# EAGLE design Small 2 (EAGLE 9.5.2)
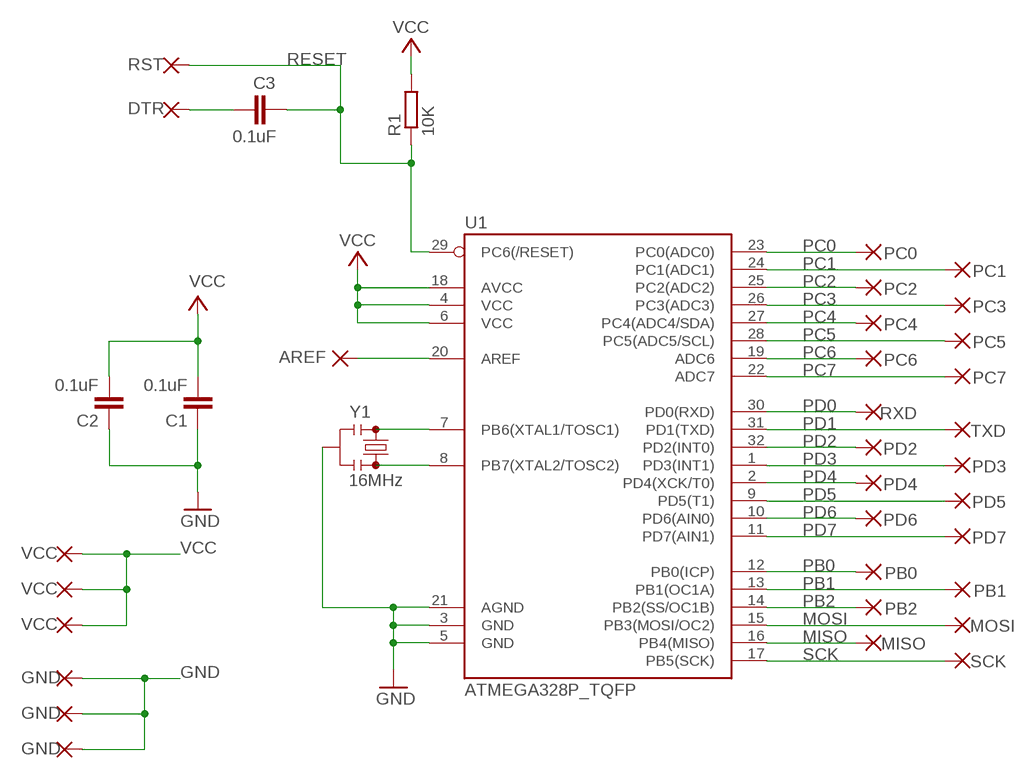
[diagram p0: schematic, sheet 1]

## Parts
AREF  1,6/0,8  [1,6/0,8]
C1  0.1uF  C-EUC0603  [C0603]
C2  0.1uF  C-EUC0603  [C0603]
C3  0.1uF  C-EUC0603  [C0603]
DTR  1,6/0,8  [1,6/0,8]
DTR1  RST  1,6/0,8  [1,6/0,8]
GND  GND  1,6/0,8  [1,6/0,8]
GND3  GND  1,6/0,8  [1,6/0,8]
GND4  GND  1,6/0,8  [1,6/0,8]
MISO  MISO  1,6/0,8  [1,6/0,8]
MOSI  MOSI  1,6/0,8  [1,6/0,8]
PB0  1,6/0,8  [1,6/0,8]
PB1  1,6/0,8  [1,6/0,8]
PB2  1,6/0,8  [1,6/0,8]
PC0  1,6/0,8  [1,6/0,8]
PC1  1,6/0,8  [1,6/0,8]
PC2  1,6/0,8  [1,6/0,8]
PC3  1,6/0,8  [1,6/0,8]
PC4  1,6/0,8  [1,6/0,8]
PC5  1,6/0,8  [1,6/0,8]
PC6  1,6/0,8  [1,6/0,8]
PC7  1,6/0,8  [1,6/0,8]
PD2  1,6/0,8  [1,6/0,8]
PD3  1,6/0,8  [1,6/0,8]
PD4  1,6/0,8  [1,6/0,8]
PD5  1,6/0,8  [1,6/0,8]
PD6  1,6/0,8  [1,6/0,8]
PD7  1,6/0,8  [1,6/0,8]
R1  10K  R-EU_R0603  [R0603]
RXD  1,6/0,8  [1,6/0,8]
SCK  SCK  1,6/0,8  [1,6/0,8]
TXD  1,6/0,8  [1,6/0,8]
U1  ATMEGA328P_TQFP  [TQFP32-08]
VCC  VCC  1,6/0,8  [1,6/0,8]
VCC1  VCC  1,6/0,8  [1,6/0,8]
VCC2  VCC  1,6/0,8  [1,6/0,8]
Y1  16MHz  RESONATOR-16MHZSMD_3.2X1.3  [RESONATOR-SMD-3.2X1.3]

## Nets
GND: C1.1 C2.1 GND3.1(P) GND4.1(P) GND.1(P) U1.3(GND) U1.5(GND) U1.21(AGND) Y1.2
MISO: MISO.1(P) U1.16(PB4(MISO))
MOSI: MOSI.1(P) U1.15(PB3(MOSI/OC2))
N$1: C3.1 DTR.1(P)
N$2: U1.7(PB6(XTAL1/TOSC1)) Y1.1
N$3: U1.8(PB7(XTAL2/TOSC2)) Y1.3
N$5: AREF.1(P) U1.20(AREF)
PB0: PB0.1(P) U1.12(PB0(ICP))
PB1: PB1.1(P) U1.13(PB1(OC1A))
PB2: PB2.1(P) U1.14(PB2(SS/OC1B))
PC0: PC0.1(P) U1.23(PC0(ADC0))
PC1: PC1.1(P) U1.24(PC1(ADC1))
PC2: PC2.1(P) U1.25(PC2(ADC2))
PC3: PC3.1(P) U1.26(PC3(ADC3))
PC4: PC4.1(P) U1.27(PC4(ADC4/SDA))
PC5: PC5.1(P) U1.28(PC5(ADC5/SCL))
PC6: PC6.1(P) U1.19(ADC6)
PC7: PC7.1(P) U1.22(ADC7)
PD0: RXD.1(P) U1.30(PD0(RXD))
PD1: TXD.1(P) U1.31(PD1(TXD))
PD2: PD2.1(P) U1.32(PD2(INT0))
PD3: PD3.1(P) U1.1(PD3(INT1))
PD4: PD4.1(P) U1.2(PD4(XCK/T0))
PD5: PD5.1(P) U1.9(PD5(T1))
PD6: PD6.1(P) U1.10(PD6(AIN0))
PD7: PD7.1(P) U1.11(PD7(AIN1))
RESET: C3.2 DTR1.1(P) R1.1 U1.29(PC6(/RESET))
SCK: SCK.1(P) U1.17(PB5(SCK))
VCC: C1.2 C2.2 R1.2 U1.4(VCC) U1.6(VCC) U1.18(AVCC) VCC1.1(P) VCC2.1(P) VCC.1(P)

## Library data of the parts
AREF DTR DTR1 GND GND3 GND4 MISO MOSI PB0 PB1 PB2 PC0 PC1-PC7 PD2-PD7 RXD SCK TXD VCC VCC1 VCC2 = wirepad:1,6/0,8: THROUGH-HOLE PAD
C1-C3 = rcl:C-EU: CAPACITOR, European symbol; SPICEPREFIX: C
R1 = rcl:R-EU_: RESISTOR, European symbol; SPICEPREFIX: R
U1 = SparkFun-IC-Microcontroller:ATMEGA328P_TQFP: Popular 328P in QFP Storefront component: ATmega328 - TQFP <https://www.sparkfun.com/products/13448> (COM-13448) Datasheet <http://www.sparkfun.com/datasheets/Components/SMD/ATMega328.pdf> SparkFun Products SparkFun RedBoard - Programmed with Arduino <https://www.sparkfun.com/products/12757> (DEV-12757) Arduino Pro Mini 328 - 5V/16MHz <https://www.sparkfun.com/products/11113> (DEV-11113) Arduino Pro Mini 328 - 3.3V/8MHz <https://www.sparkfun.com/products/11114> (DEV-11114) SparkFun OpenLog <https://www.sparkfun.com/products/13712> (DEV-13712) SparkFun MicroView - OLED Arduino Module <https://www.sparkfun.com/products/12923> (DEV-12923) SparkFun Digital Sandbox <https://www.sparkfun.com/products/12651> (DEV-12651) SparkFun PicoBoard <https://www.sparkfun.com/products/11888> (WIG-11888) Arduino Fio <https://www.sparkfun.com/products/10116> (DEV-10116) LilyPad Arduino 328 Main Board <https://www.sparkfun.com/products/13342> (DEV-13342) SparkFun RedStick <https://www.sparkfun.com/products/13741> (DEV-13741) LilyPad MP3 <https://www.sparkfun.com/products/11013> (DEV-11013) LilyPad Arduino SimpleSnap <https://www.sparkfun.com/products/10941> (DEV-10941) SparkFun Stepoko <https://www.sparkfun.com/products/13899> (ROB-13899) SparkFun Geiger Counter <https://www.sparkfun.com/products/11345> (SEN-11345) SparkFun EL Sequencer <https://www.sparkfun.com/products/12781> (COM-12781) Arduino Pro 328 - 5V/16MHz <https://www.sparkfun.com/products/10915> (DEV-10915) CryptoCape <https://www.sparkfun.com/products/12773> (DEV-12773) SparkFun IR Thermometer Evaluation Board - MLX90614 <https://www.sparkfun.com/products/10740> (SEN-10740) SparkFun RedBot Mainboard <https://www.sparkfun.com/products/12097> (ROB-12097) Arduino Pro 328 - 3.3V/8MHz <https://www.sparkfun.com/products/10914> (DEV-10914) SparkFun Block for Intel® Edison - Arduino <https://www.sparkfun.com/products/13036> (DEV-13036) SparkFun Simon Says - Surface Mount Soldering Kit <https://www.sparkfun.com/products/10935> (KIT-10935) SparkFun 7-Segment Serial Display - Red <https://www.sparkfun.com/products/11441> (COM-11441) SparkFun 7-Segment Serial Display - White <https://www.sparkfun.com/products/11629> (COM-11629) SparkFun 7-Segment Serial Display - Yellow <https://www.sparkfun.com/products/11443> (COM-11443) SparkFun 7-Segment Serial Display - Kelly Green <https://www.sparkfun.com/products/11440> (COM-11440) SparkFun 7-Segment Serial Display - Blue <https://www.sparkfun.com/products/11442> (COM-11442) SparkFun OpenSegment Serial Display - 20mm (Blue) <https://www.sparkfun.com/products/11647> (COM-11647) SparkFun OpenSegment Serial Display - 20mm (Green) <https://www.sparkfun.com/products/11646> (COM-11646) SparkFun OpenSegment Serial Display - 20mm (White) <https://www.sparkfun.com/products/11648> (COM-11648) SparkFun OpenSegment Serial Display - 20mm (Red) <https://www.sparkfun.com/products/11644> (COM-11644) SparkFun OpenSegment Serial Display - 20mm (Yellow) <https://www.sparkfun.com/products/11645> (COM-11645) SparkFun OpenSegment Shield <https://www.sparkfun.com/products/13190> (DEV-13190); PROD_ID: IC-09069
Y1 = SparkFun-Clocks:RESONATOR-16MHZ: 16MHz Resonator Digikey Example <http://www.digikey.com/product-detail/en/murata-electronics-north-america/CSTCE16M0V53-R0/490-1198-1-ND/584635> Frequency: 16MHz Frequency Stability: ±0.3% Frequency Tolerance: ±0.5% Capacitance: 15pF SparkFun Products SparkFun OpenLog <https://www.sparkfun.com/products/13712> SparkFun MicroView - OLED Arduino Module <https://www.sparkfun.com/products/12923>; PROD_ID: XTAL-08900

## Board
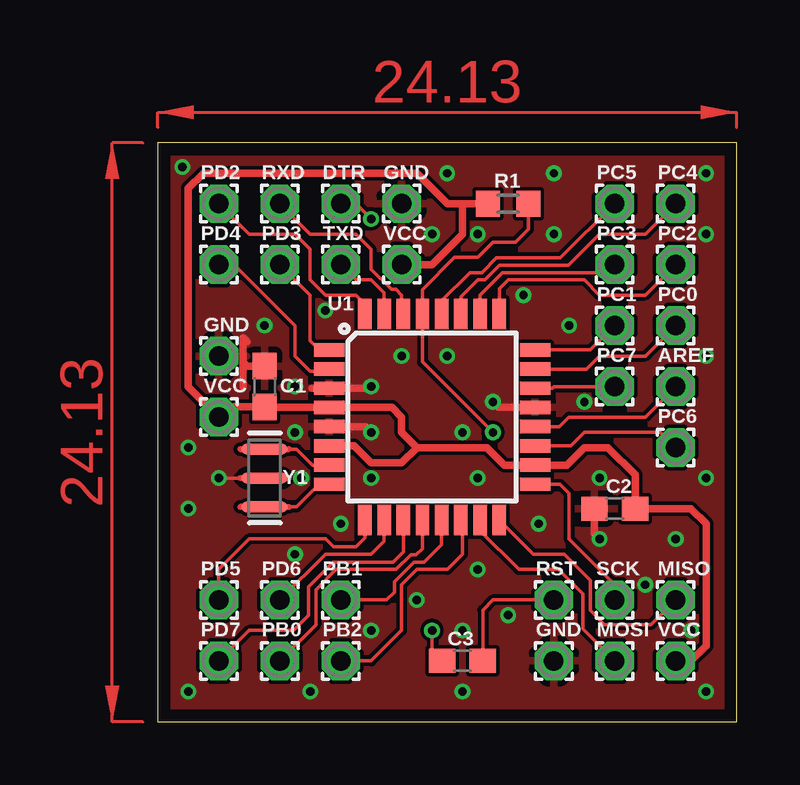
[diagram p1: board, top side]
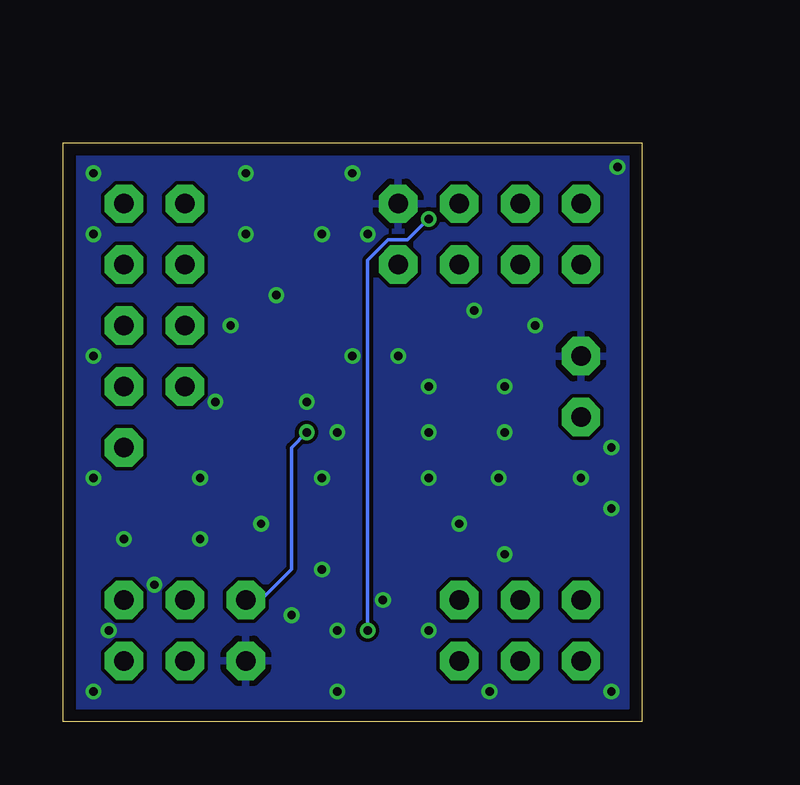
[diagram p2: board, bottom side, seen from below]

Size 24.13 x 24.12 mm. Coordinates in mm from the lower left corner, seen from the top.
Outline: 0,0 24.13,0 24.13,24.12 0,24.12 0,0
Copper layers (1*16): Top 0.035mm / dielectric 1.6mm / Bottom 0.035mm
Design rules "Elecrow_2-layer_PCB_eagle_rule": minimum track width 6mil, minimum drill 12mil, track to track 6mil, track to pad 6mil, pad to pad 6mil, via to via 8mil, smd to smd 0mil, copper to edge 20mil, drill to drill 10mil, minimum pad ring 6mil, minimum via ring 6mil, stop-mask expansion 0mil, vias tented up to drill 100mil, thermal gap 10mil

### Footprints (pad centres in the part's own frame; a part is rotated, then mirrored left to right if it is on the bottom)
1,6/0,8 = drill 0.813 pad 1.6 octagon: 1 0,0
C0603 = smd 1.1 x 1: 1 -0.85,0; 2 0.85,0
R0603 = smd 1 x 1.1: 1 -0.85,0; 2 0.85,0
TQFP32-08 = smd 1.27 x 0.559: 1 -4.293,2.8; 2 -4.293,2; 3 -4.293,1.2; 4 -4.293,0.4; 5 -4.293,-0.4; 6 -4.293,-1.2; 7 -4.293,-2; 8 -4.293,-2.8; 17 4.293,-2.8; 18 4.293,-2; 19 4.293,-1.2; 20 4.293,-0.4; 21 4.293,0.4; 22 4.293,1.2; 23 4.293,2; 24 4.293,2.8 | smd 0.559 x 1.27: 9 -2.8,-4.293; 10 -2,-4.293; 11 -1.2,-4.293; 12 -0.4,-4.293; 13 0.4,-4.293; 14 1.2,-4.293; 15 2,-4.293; 16 2.8,-4.293; 25 2.8,4.293; 26 2,4.293; 27 1.2,4.293; 28 0.4,4.293; 29 -0.4,4.293; 30 -1.2,4.293; 31 -2,4.293; 32 -2.8,4.293
RESONATOR-SMD-3.2X1.3 = smd 0.45 x 1.905: 1 -1.2,0; 2 0,0; 3 1.2,0

### Placement (x,y rotation side)
AREF  21.59,13.97 0 top
C1  4.45,13.97 270 top
C2  19.05,8.89 0 top
C3  12.7,2.54 0 top
DTR  7.62,21.59 0 top
DTR1  16.51,5.08 0 top
GND  16.51,2.54 0 top
GND3  2.54,15.24 0 top
GND4  10.16,21.59 0 top
MISO  21.59,5.08 0 top
MOSI  19.05,2.54 0 top
PB0  5.08,2.54 0 top
PB1  7.62,5.08 0 top
PB2  7.62,2.54 0 top
PC0  21.59,16.51 0 top
PC1  19.05,16.51 0 top
PC2  21.59,19.05 0 top
PC3  19.05,19.05 0 top
PC4  21.59,21.59 0 top
PC5  19.05,21.59 0 top
PC6  21.59,11.43 0 top
PC7  19.05,13.97 0 top
PD2  2.54,21.59 0 top
PD3  5.08,19.05 0 top
PD4  2.54,19.05 0 top
PD5  2.54,5.08 0 top
PD6  5.08,5.08 0 top
PD7  2.54,2.54 0 top
R1  14.61,21.59 180 top
RXD  5.08,21.59 0 top
SCK  19.05,5.08 0 top
TXD  7.62,19.05 0 top
U1  11.43,12.7 0 top
VCC  10.16,19.05 0 top
VCC1  21.59,2.54 0 top
VCC2  2.54,12.7 0 top
Y1  4.45,10.16 270 top

### Tracks (layer width: path | path; a pad name or v marks a point on that pad's centre or on a via)
GND  (via drill 0.35)
  Top 0.152: Y1.2 v2.54,10.16
  Top 0.305: 6.42,13.9 U1.3 8.82,13.9 v8.89,13.97 | 3.17,15.24 GND3.1 | U1.5 8.65,12.3 v8.89,12.06 | U1.21 14.21,13.1 v13.97,13.34 | C2.1 18.2,7.83 v18.41,7.62 | C1.1 3.72,14.82 3.56,14.99 | 3.56,14.99 3.56,16 3.72,15.84 | 3.56,14.99 3.56,13.97
  other vias: 17.14,16.51 15.88,8.26 20.32,5.71 22.86,10.16 12.7,12.06 8.89,10.16 7.62,8.26 6.99,17.14 4.45,16.51 11.43,20.32 22.86,1.27 12.7,1.27 6.35,1.27 1.27,1.27 1.27,8.89 1.27,11.43 5.71,12.06 22.86,15.24 22.86,22.86 12.06,22.86 16.51,22.86 22.86,20.32 12.06,15.24 10.16,15.24 18.41,10.16 17.78,13.34 21.59,7.62 10.79,5.08 14.61,4.45 16.51,20.32 13.34,20.32 15.24,17.78 13.34,6.35 12.7,3.81 5.71,13.97 13.34,10.16 8.89,3.81 5.71,6.99 22.23,3.81 1.02,23.11 5.97,10.16
  pour Bottom: 0.64,23.5 23.5,23.5 23.5,0.64 0.64,0.64
  pour Top: 0.64,23.5 23.5,23.5 23.5,0.64 0.64,0.64
MISO
  Top 0.152: MISO.1 20.56,4.05 18.62,4.05 18.02,4.65 18.02,5.91 16.94,6.99 15.65,6.99 U1.16
MOSI
  Top 0.152: U1.15 13.43,7.97 15.05,6.35 16.7,6.35 17.72,5.33 17.72,3.87 MOSI.1
N$1  (via drill 0.35)
  Top 0.152: DTR.1 8.26,21.59 v8.89,20.95 | v11.43,3.81 11.43,2.96 C3.1
  Bottom 0.152: v8.89,20.95 9.77,20.08 10.59,20.08 11.43,19.23 v11.43,3.81
N$2
  Top 0.152: U1.7 6.45,10.7 5.79,11.36 Y1.1
N$3
  Top 0.152: Y1.3 5.79,8.96 6.72,9.9 U1.8
N$5
  Top 0.152: U1.20 16.75,12.3 17.14,12.7 20.32,12.7 AREF.1
PB0
  Top 0.152: U1.12 11.03,7.22 10.77,6.96 10.54,6.96 9.93,6.35 7.43,6.35 6.59,5.51 6.59,4.05 PB0.1
PB1
  Top 0.152: U1.13 11.83,7.38 11.1,6.66 10.67,6.66 9.86,5.84 9.86,5.41 9.53,5.08 PB1.1
PB2
  Top 0.152: U1.14 12.7,8.34 12.7,6.99 12.06,6.35 10.79,6.35 10.16,5.71 10.16,3.81 8.89,2.54 PB2.1
PC0
  Top 0.152: U1.23 17.88,14.7 18.41,15.24 20.32,15.24 PC0.1
PC1
  Top 0.152: U1.24 18.04,15.5 PC1.1
PC2
  Top 0.152: U1.25 14.23,18.04 14.61,18.41 17.78,18.41 18.41,17.78 20.32,17.78 PC2.1
PC3
  Top 0.152: U1.26 13.43,17.78 14.37,18.72 18.72,18.72 PC3.1
PC4
  Top 0.152: U1.27 12.63,17.71 13.34,18.41 13.63,18.41 14.24,19.02 17.12,19.02 18.41,20.32 20.32,20.32 PC4.1
PC5
  Top 0.152: U1.28 11.83,17.55 13.01,18.72 13.51,18.72 14.12,19.33 16.79,19.33 PC5.1
PC6
  Top 0.152: U1.19 17.21,11.5 17.78,12.06 20.95,12.06 PC6.1
PC7
  Top 0.152: U1.22 16.44,13.9 16.51,13.97 PC7.1
PD0
  Top 0.152: U1.30 10.16,17.06 10.16,17.78 9.92,18.02 9.73,18.02 8.89,18.86 8.89,19.68 8.26,20.32 6.35,20.32 RXD.1
PD1
  Top 0.152: U1.31 9.43,17.88 8.89,18.41 8.26,18.41 TXD.1
PD2
  Top 0.152: U1.32 8.63,17.41 8.26,17.78 6.99,17.78 6.35,18.41 6.35,19.68 5.71,20.32 3.81,20.32 PD2.1
PD3
  Top 0.152: U1.1 6.72,15.5 6.35,15.88 6.35,17.78 PD3.1
PD4
  Top 0.152: U1.2 7.04,14.61 6.35,14.61 5.71,15.24 5.71,16.51 3.17,19.05 PD4.1
PD5
  Top 0.152: U1.9 8.63,7.67 8.26,7.29 7.32,7.29 6.99,7.62 3.81,7.62 2.54,6.35 PD5.1
PD6
  Top 0.152: U1.10 9.43,7.53 8.89,6.99 6.99,6.99 PD6.1
PD7
  Top 0.152: U1.11 10.23,7.08 9.81,6.66 7.31,6.66 6.29,5.63 6.29,4.45 5.65,3.81 3.81,3.81 PD7.1
RESET  (via drill 0.35)
  Top 0.152: DTR1.1 13.97,5.08 13.55,4.66 C3.2 | v13.97,12.06 11.03,15.01 U1.29 11.03,18.02 12.37,19.36 13.34,19.36 13.97,19.99 14.91,19.99 15.46,20.54 R1.1
  Bottom 0.152: v13.97,12.06 14.61,11.43 14.61,6.35 15.88,5.08 DTR1.1
SCK
  Top 0.152: U1.17 16.77,9.9 17.14,9.53 17.14,7.62 19.05,5.71 SCK.1
VCC
  Top 0.305: VCC1.1 22.23,2.54 22.86,3.17 22.86,8.26 22.23,8.89 C2.2 19.9,10.29 18.76,11.43 17.78,11.43 17.05,10.7 U1.18 14.45,10.7 13.72,11.43 10.79,11.43 | U1.6 8.19,11.5 8.89,10.79 10.16,10.79 10.79,11.43 | 12.7,21.59 12.06,21.59 10.79,22.86 1.91,22.86 1.27,22.23 1.27,13.97 VCC2.1 2.96,13.12 C1.2 4.46,13.1 U1.4 9.76,13.1 10.16,12.7 10.16,12.06 10.79,11.43 | 12.7,21.59 R1.2 | 12.7,21.59 12.7,20.32 11.43,19.05 VCC.1
(copper drawn outside any net)
  shapes: Top area x2

### Text on the board
tNames: GND | GND | VCC | RST | SCK | VCC